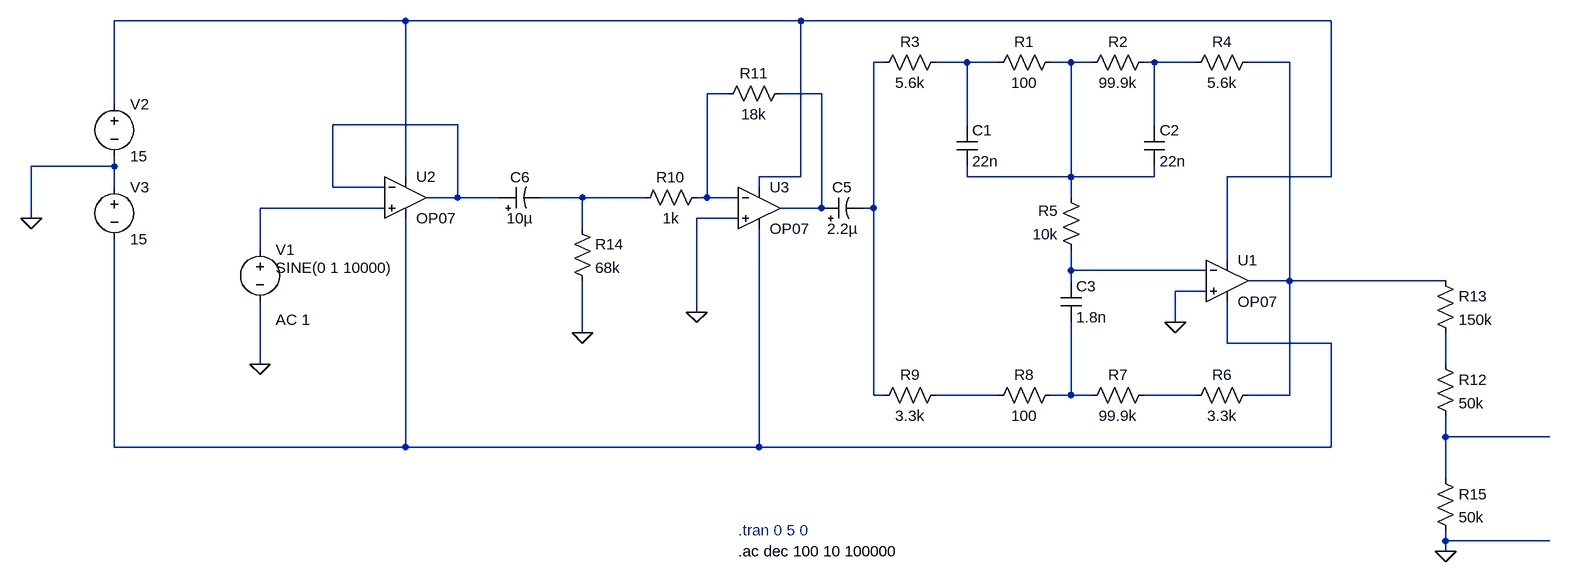
[diagram p0: schematic pre amp.asc]
pre amp.asc, the LTspice schematic file:
Version 4
SHEET 1 932 680
WIRE -960 -160 -1408 -160
WIRE -352 -160 -960 -160
WIRE 464 -160 -352 -160
WIRE -224 -96 -240 -96
WIRE -96 -96 -144 -96
WIRE -48 -96 -96 -96
WIRE 64 -96 32 -96
WIRE 96 -96 64 -96
WIRE 192 -96 176 -96
WIRE 256 -96 192 -96
WIRE 400 -96 336 -96
WIRE -464 -48 -496 -48
WIRE -320 -48 -384 -48
WIRE -1408 -32 -1408 -160
WIRE -880 0 -1072 0
WIRE -96 0 -96 -96
WIRE 192 0 192 -96
WIRE -1408 64 -1408 48
WIRE -1408 64 -1536 64
WIRE -960 80 -960 -160
WIRE -352 80 -352 -160
WIRE -352 80 -416 80
WIRE -96 80 -96 64
WIRE 64 80 64 -96
WIRE 64 80 -96 80
WIRE 192 80 192 64
WIRE 192 80 64 80
WIRE 464 80 464 -160
WIRE 464 80 304 80
WIRE -1408 96 -1408 64
WIRE -1072 96 -1072 0
WIRE -992 96 -1072 96
WIRE -416 96 -416 80
WIRE -880 112 -880 0
WIRE -880 112 -928 112
WIRE -816 112 -880 112
WIRE -688 112 -752 112
WIRE -592 112 -688 112
WIRE -496 112 -496 -48
WIRE -496 112 -512 112
WIRE -448 112 -496 112
WIRE 64 112 64 80
WIRE -992 128 -1184 128
WIRE -320 128 -320 -48
WIRE -320 128 -384 128
WIRE -240 128 -240 -96
WIRE -240 128 -256 128
WIRE -1536 144 -1536 64
WIRE -448 144 -512 144
WIRE -688 160 -688 112
WIRE -1184 192 -1184 128
WIRE 304 208 304 80
WIRE 64 224 64 192
WIRE 272 224 64 224
WIRE 64 240 64 224
WIRE 400 240 400 -96
WIRE 400 240 336 240
WIRE 640 240 400 240
WIRE 272 256 224 256
WIRE -512 288 -512 144
WIRE 224 304 224 256
WIRE -688 320 -688 240
WIRE 304 336 304 272
WIRE 464 336 304 336
WIRE -1184 368 -1184 272
WIRE 640 368 640 320
WIRE -240 416 -240 128
WIRE -224 416 -240 416
WIRE -48 416 -144 416
WIRE 64 416 64 304
WIRE 64 416 32 416
WIRE 96 416 64 416
WIRE 256 416 176 416
WIRE 400 416 400 240
WIRE 400 416 336 416
WIRE 640 480 640 448
WIRE 800 480 640 480
WIRE -1408 496 -1408 176
WIRE -960 496 -960 144
WIRE -960 496 -1408 496
WIRE -416 496 -416 160
WIRE -416 496 -960 496
WIRE 464 496 464 336
WIRE 464 496 -416 496
WIRE 640 544 640 480
WIRE 640 640 640 624
WIRE 800 640 640 640
WIRE 640 656 640 640
FLAG -1184 368 0
FLAG 224 304 0
FLAG -1536 144 0
FLAG -512 288 0
FLAG -688 320 0
FLAG 640 656 0
SYMBOL OpAmps\\OP07 304 176 R0
SYMATTR InstName U1
SYMBOL voltage -1184 176 R0
WINDOW 3 24 44 Left 2
WINDOW 123 24 124 Left 2
WINDOW 39 0 0 Left 0
SYMATTR Value SINE(0 1 10000)
SYMATTR Value2 AC 1
SYMATTR InstName V1
SYMBOL res 48 -112 R90
WINDOW 0 0 56 VBottom 2
WINDOW 3 32 56 VTop 2
SYMATTR InstName R1
SYMATTR Value 100
SYMBOL res 192 -112 R90
WINDOW 0 0 56 VBottom 2
WINDOW 3 32 56 VTop 2
SYMATTR InstName R2
SYMATTR Value 99.9k
SYMBOL res -128 -112 R90
WINDOW 0 0 56 VBottom 2
WINDOW 3 32 56 VTop 2
SYMATTR InstName R3
SYMATTR Value 5.6k
SYMBOL res 352 -112 R90
WINDOW 0 0 56 VBottom 2
WINDOW 3 32 56 VTop 2
SYMATTR InstName R4
SYMATTR Value 5.6k
SYMBOL res 80 208 R180
WINDOW 0 36 76 Left 2
WINDOW 3 36 40 Left 2
SYMATTR InstName R5
SYMATTR Value 10k
SYMBOL res 240 432 R270
WINDOW 0 32 56 VTop 2
WINDOW 3 0 56 VBottom 2
SYMATTR InstName R6
SYMATTR Value 3.3k
SYMBOL res 80 432 R270
WINDOW 0 32 56 VTop 2
WINDOW 3 0 56 VBottom 2
SYMATTR InstName R7
SYMATTR Value 99.9k
SYMBOL res -64 432 R270
WINDOW 0 32 56 VTop 2
WINDOW 3 0 56 VBottom 2
SYMATTR InstName R8
SYMATTR Value 100
SYMBOL res -240 432 R270
WINDOW 0 32 56 VTop 2
WINDOW 3 0 56 VBottom 2
SYMATTR InstName R9
SYMATTR Value 3.3k
SYMBOL cap -112 0 R0
SYMATTR InstName C1
SYMATTR Value 22n
SYMBOL cap 176 0 R0
SYMATTR InstName C2
SYMATTR Value 22n
SYMBOL cap 48 240 R0
SYMATTR InstName C3
SYMATTR Value 1.8n
SYMBOL voltage -1408 -48 R0
WINDOW 123 0 0 Left 0
WINDOW 39 0 0 Left 0
SYMATTR InstName V2
SYMATTR Value 15
SYMBOL voltage -1408 80 R0
WINDOW 123 0 0 Left 0
WINDOW 39 0 0 Left 0
SYMATTR InstName V3
SYMATTR Value 15
SYMBOL OpAmps\\OP07 -960 48 R0
SYMATTR InstName U2
SYMBOL OpAmps\\OP07 -416 64 R0
SYMATTR InstName U3
SYMBOL res -496 96 R90
WINDOW 0 0 56 VBottom 2
WINDOW 3 32 56 VTop 2
SYMATTR InstName R10
SYMATTR Value 1k
SYMBOL res -368 -64 R90
WINDOW 0 0 56 VBottom 2
WINDOW 3 32 56 VTop 2
SYMATTR InstName R11
SYMATTR Value 18k
SYMBOL res 624 352 R0
SYMATTR InstName R12
SYMATTR Value 50k
SYMBOL polcap -320 144 R270
WINDOW 0 32 32 VTop 2
WINDOW 3 0 32 VBottom 2
SYMATTR InstName C5
SYMATTR Value 2.2µ
SYMATTR Description Capacitor
SYMATTR Type cap
SYMATTR SpiceLine V=50 Irms=13m Rser=2.1921 Lser=1.369n mfg="Würth Elektronik" pn="865090640006 WCAP-ASLU 4x5,5" type="Al electrolytic"
SYMBOL res 624 224 R0
SYMATTR InstName R13
SYMATTR Value 150k
SYMBOL polcap -816 128 R270
WINDOW 0 32 32 VTop 2
WINDOW 3 0 32 VBottom 2
SYMATTR InstName C6
SYMATTR Value 10µ
SYMATTR Description Capacitor
SYMATTR Type cap
SYMATTR SpiceLine V=50 Irms=13m Rser=2.1921 Lser=1.369n
SYMBOL res -704 144 R0
SYMATTR InstName R14
SYMATTR Value 68k
SYMBOL res 624 528 R0
SYMATTR InstName R15
SYMATTR Value 50k
TEXT -448 656 Left 2 !.ac dec 100 10 100000
TEXT -448 624 Left 2 ;.tran 0 5 0

The netlist it stands for:
* pre amp.asc
XU1 0 N012 N001 N013 N006 LT1001  ; OP07, pins In+ In- V+ V- OUT
V1 N011 0 SINE(0 1 10000) AC 1
R1 N004 N003 100
R2 N005 N004 99.9k
R3 N003 N002 5.6k
R4 N006 N005 5.6k
R5 N012 N004 10k
R6 N017 N006 3.3k
R7 N016 N017 99.9k
R8 N015 N016 100
R9 N002 N015 3.3k
C1 N003 N004 22n
C2 N005 N004 22n
C3 N012 N016 1.8n
V2 N001 0 15
V3 0 N013 15
XU2 N011 N009 N001 N013 N009 LT1001  ; OP07, pins In+ In- V+ V- OUT
XU3 0 N007 N001 N013 N008 LT1001  ; OP07, pins In+ In- V+ V- OUT
R10 N007 N010 1k
R11 N008 N007 18k
R12 N014 N018 50k
C5 N008 N002 2.2µ V=50 Irms=13m Rser=2.1921 Lser=1.369n mfg="Würth Elektronik" pn="865090640006 WCAP-ASLU 4x5,5" type="Al electrolytic"
R13 N006 N014 150k
C6 N009 N010 10µ V=50 Irms=13m Rser=2.1921 Lser=1.369n
R14 N010 0 68k
R15 N018 0 50k
.ac dec 100 10 100000
* .tran 0 5 0
.lib LTC.lib
.backanno
.end